# Altium project UWARG_PDB.PrjPcb
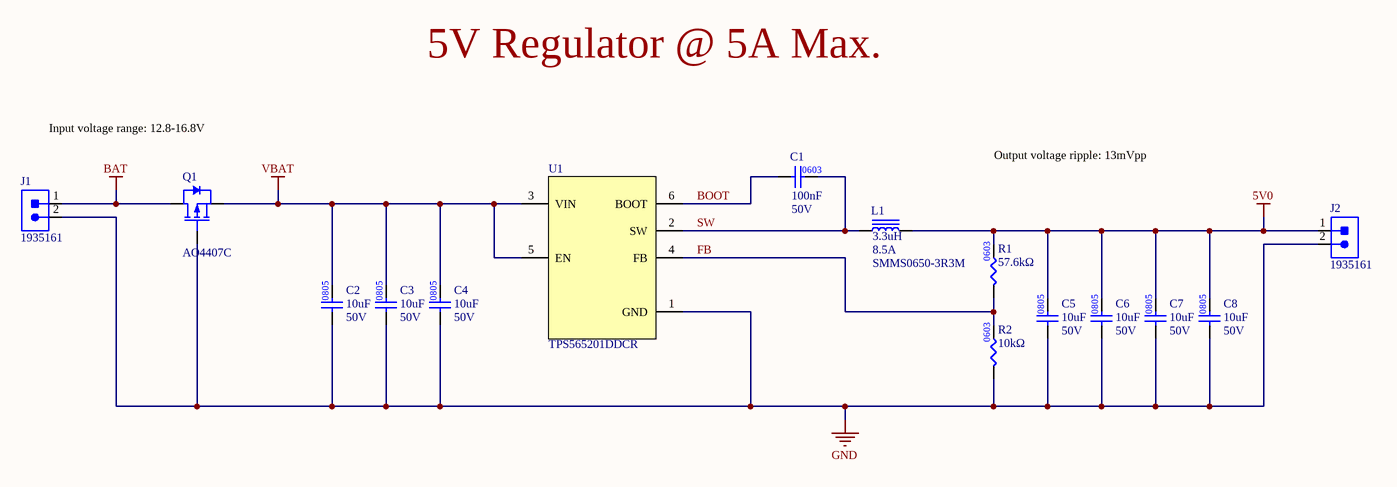
[diagram p0: PDB.SchDoc]
1 sheet, 15 parts. Net scope: global (net labels, ports and power ports of the same name join across sheets).
Board file: PDB.PcbDoc

## Sheet PDB.SchDoc
size A4; SheetNumber: 1; SheetTotal: 1

### Parts
C1  value 100nF  Voltage: 50V  [CAP0603]  (hidden comment: CAP_100nF_50V_0603)
C2  value 10uF  Voltage: 50V  [CAP0805]  (hidden comment: CAP_10uF_50V_0805)
C3  value 10uF  Voltage: 50V  [CAP0805]  (hidden comment: CAP_10uF_50V_0805)
C4  value 10uF  Voltage: 50V  [CAP0805]  (hidden comment: CAP_10uF_50V_0805)
C5  value 10uF  Voltage: 50V  [CAP0805]  (hidden comment: CAP_10uF_50V_0805)
C6  value 10uF  Voltage: 50V  [CAP0805]  (hidden comment: CAP_10uF_50V_0805)
C7  value 10uF  Voltage: 50V  [CAP0805]  (hidden comment: CAP_10uF_50V_0805)
C8  value 10uF  Voltage: 50V  [CAP0805]  (hidden comment: CAP_10uF_50V_0805)
J1  CON_2POS_SCREW_TERM  [1935161]  (value not drawn)
J2  CON_2POS_SCREW_TERM  [1935161]  (value not drawn)
L1  value 3.3uH  Current Rating: 8.5A  [SMMS0650-3R3M]  (hidden comment: IND_3.3uH_8.5A)
Q1  Manufacturer Part Number 1: AO4407C  [SO-8_PMOS_AO4407C]  (hidden comment: PMOS_30V_14A)
R1  value 57.6kΩ  [RES0603]  (hidden comment: RES_57.6kΩ_0603_1%)
R2  value 10kΩ  [RES0603]  (hidden comment: RES_10kΩ_0603_1%)
U1  TPS565201DDCR  [TPS565201DDCR]

### Nets
5V0: C5.2 C6.2 C7.2 C8.2 J2.1 L1.2 R1.2
BAT: J1.1 Q1.3(Drain)
GND: C2.1 C3.1 C4.1 C5.1 C6.1 C7.1 C8.1 J1.2 J2.2 Q1.2(Gate) R2.1 U1.1(GND)
VBAT: C2.2 C3.2 C4.2 Q1.1(Source) U1.3(VIN) U1.5(EN)
BOOT: C1.1 U1.6(BOOT)
FB: R1.1 R2.2 U1.4(FB)
SW: C1.2 L1.1 U1.2(SW)

### Notes on the sheet
- 5V Regulator @ 5A Max.
- Input voltage range: 12.8-16.8V
- Output voltage ripple: 13mVpp

### Library data of the parts
C1 = CAP_100nF_50V_0603: CAP CER 100NF 50V X7R 0603; Manufacturer 1: KEMET; Manufacturer Part Number 1: C0603C104K5RACAUTO; Tolerance: 10%; Supplier 1: LCSC; Supplier Part Number 1: C129621; Temperature Coefficient: X7R; Package: 0603; Mounting Type: Surface Mount; LCSC Part #: C129621
C2-C8 = CAP_10uF_50V_0805: CAP CER 10UF 50V X5R 0805; Manufacturer 1: Murata Electronics; Manufacturer Part Number 1: GRM21BR61H106KE43L; Tolerance: 10%; Supplier 1: LCSC; Supplier Part Number 1: C440198; Supplier 2: Digi-Key; Supplier Part Number 2: 490-18663-1-ND; Temperature Coefficient: X5R; Package: 0805; Mounting Type: Surface Mount; LCSC Part #: C440198
J1 J2 = CON_2POS_SCREW_TERM: TERM BLK 2POS SIDE ENTRY 5MM; Manufacturer 1: Phoenix Contact; Package/Footprint: SMD; Supplier 1: Digi-Key; Mounting Type: TH; Supplier Part Number 1: 277-1667-ND; Manufacturer Part Number 1: 1935161
L1 = IND_3.3uH_8.5A: IND 3.3UH 8.5A 22M OHM; Manufacturer 1: Shun Xiang Nuo Elec; Tolerance: 20%; Saturation Current: 9A; Test Frequency: 100kHz; DC Resistance: 20mΩ; Mounting Type: Surface Mount; Supplier 1: LCSC; Supplier Part Number 1: C149581; Manufacturer Part Number 1: SMMS0650-3R3M; LCSC Part #: C149581
Q1 = PMOS_30V_14A: MOSFET P-CH 30V 14A SO-8; Manufacturer 1: Alpha & Omega Semicon; Drain to Source On-Resistance: 11.5mΩ; Max Power Dissipation: 3.1W; Drain to Source Voltage: -30V; Turn-Off Delay Time: 40ns; Turn-On Delay Time: 11ns; Gate to Source Voltage: ±25V; Continuous Drain Current: -14A; Supplier 1: LCSC; Supplier Part Number 1: C469397; Drain to Source Breakdown Voltage: -30V; Package: SO-8; LCSC Part #: C469397
R1 = RES_57.6kΩ_0603_1%: RES 57.6K OHM 1% 1/10W 0603; Manufacturer 1: Uniroyal Elec; Manufacturer Part Number 1: 0603WAF5762T5E; Supplier 1: LCSC; Supplier Part Number 1: C23082; Tolerance: 1%; Package: 0603; Mounting Type: Surface Mount; LCSC Part #: C23082
R2 = RES_10kΩ_0603_1%: RES 10K OHM 1% 1/10W 0603; Manufacturer 1: Uniroyal Elec; Manufacturer Part Number 1: 0603WAF1002T5E; Supplier 1: LCSC; Supplier Part Number 1: C25804; Tolerance: 1%; Package: 0603; Mounting Type: Surface Mount; LCSC Part #: C25804
U1 = TPS565201DDCR: IC REG BUCK ADJ 5A TSOT23-6; Manufacturer: Texas Instruments; Supplier 1: LCSC; Supplier Part Number 1: C327676; Mounting Type: Surface Mount; Package: SOT-23-6; ComponentLink1URL: http://www.ti.com/lit/ds/symlink/tps565201.pdf?src-supplier=Digi-Key; ComponentLink1Description: http://www.ti.com/lit/ds/symlink/tps565201.pdf?src-supplier=Digi-Key; Supplier 2: Digi-Key; Supplier Part Number 2: 296-49006-1-ND; Manufacturer Part Number: TPS565201DDCR; LCSC Part #: C327676